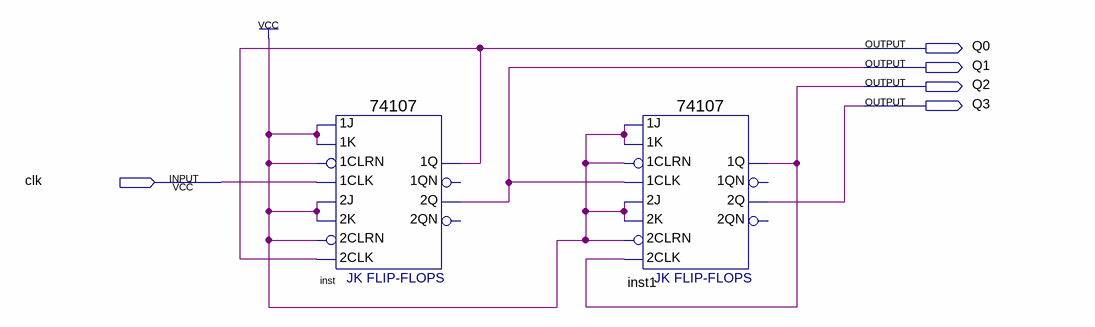
[diagram p0: schematic sheet]
// Quartus schematic counter.bdf as structural Verilog: 2 symbols, 5 pins
module counter (
  input  clk,
  output Q0,
  output Q1,
  output Q2,
  output Q3
);

  \74107  inst (
    .\1CLRN (1'b1), .\1K (1'b1), .\1J (1'b1), .\2K (1'b1), .\2J (1'b1), .\1CLK (clk), .\2CLK (Q0),
    .\2CLRN (1'b1), .\1Q (Q0), .\2Q (Q1));  // open: 1QN, 2QN
  \74107  inst1 (
    .\1CLRN (1'b1), .\1K (1'b1), .\1J (1'b1), .\2K (1'b1), .\2J (1'b1), .\1CLK (Q1), .\2CLK (Q2),
    .\2CLRN (1'b1), .\1Q (Q2), .\2Q (Q3));  // open: 1QN, 2QN
endmodule
